# Altium schematic sheet Attenuator.SchDoc: =ProjectName
size 420 x 297 mm; Author: SBH; CompanyName: WUT; DrawnBy: SBH; Organization: CERN; Address1: Warsaw Univeristy of Technology; Address2: Nowowiejska 15/19; Revision: -; SheetNumber: -; SheetTotal: -; EDA_Number: ARTIQ; Projet: ADC/DAC MEZZANINE; ModifiedBy: -; CreateDate: XX/XX/XXXX; CheckedDate: -; Title2: Attenuator.SchDoc; DivGrp: ISE; Designer: SBH; ModifiedDate: -; ProjectName: ADC/DAC MEZZANINE
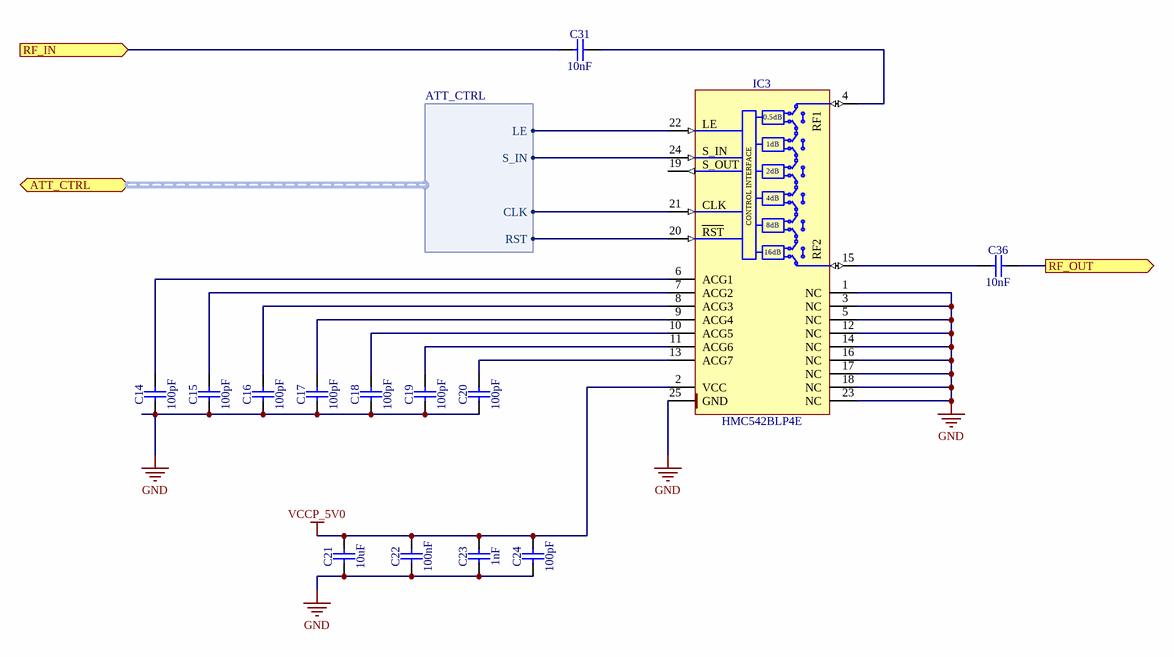
[diagram p0: Attenuator.SchDoc]

## Parts
C14  100pF  [CAPC1005X55N]
C15  100pF  [CAPC1005X55N]
C16  100pF  [CAPC1005X55N]
C17  100pF  [CAPC1005X55N]
C18  100pF  [CAPC1005X55N]
C19  100pF  [CAPC1005X55N]
C20  100pF  [CAPC1005X55N]
C21  10uF  [CAPC1608X80N]
C22  100nF  [CAPC1005X55N]
C23  1nF  [CAPC1005X55N]
C24  100pF  [CAPC1005X55N]
C31  10nF  [CAPC1005X55N]
C36  10nF  [CAPC1005X55N]
IC3  HMC542BLP4E  [QFN50P400X400X100-25N-S295]

## Ports
ATT_CTRL (harness ATT_CTRL), RF_IN (in), RF_OUT (out)

## Harnesses
ATT_CTRL: LE, S_IN, CLK, RST

## Nets
GND: C14.1 C15.1 C16.1 C17.1 C18.1 C19.1 C20.1 C21.1 C22.1 C23.1 C24.1 IC3.1(NC) IC3.3(NC) IC3.5(NC) IC3.12(NC) IC3.14(NC) IC3.16(NC) IC3.17(NC) IC3.18(NC) IC3.23(NC) IC3.25(GND)
VCCP_5V0: C21.2 C22.2 C23.2 C24.2 IC3.2(VCC)
RF_IN: C31.1 ; port RF_IN
RF_OUT: C36.2 ; port RF_OUT
NetC14_2: C14.2 IC3.6(ACG1)
NetC15_2: C15.2 IC3.7(ACG2)
NetC16_2: C16.2 IC3.8(ACG3)
NetC17_2: C17.2 IC3.9(ACG4)
NetC18_2: C18.2 IC3.10(ACG5)
NetC19_2: C19.2 IC3.11(ACG6)
NetC20_2: C20.2 IC3.13(ACG7)
NetC31_2: C31.2 IC3.4(RF1)
NetC36_1: C36.1 IC3.15(RF2)
NetIC3_20: IC3.20(~{RESET}) ; port ATT_CTRL.RST
NetIC3_21: IC3.21(SHIFT_CLOCK) ; port ATT_CTRL.CLK
NetIC3_22: IC3.22(LATCH_ENABLE) ; port ATT_CTRL.LE
NetIC3_24: IC3.24(SERIAL_INPUT) ; port ATT_CTRL.S_IN

Not connected (* = marked no-connect by the designer): IC3 19(SERIAL_OUTPUT)

## Notes on the sheet
- Project/Equipment
- Document
- Designer
- Drawn by
- Check.by
- File
- Last Mod.
- Print Date
- Sheet
- Size
- A3
- of
- Rev
- (in symbol HMC542BLP4E) 0.5dB; LE; 1dB; S_IN; S_OUT; 2dB; CONTROL INTERFACE; 4dB; CLK; 8dB; RST; 16dB

## Library data of the parts
C14-C20 C24 = CC0402_100PF_50V_5%_C0G: Non-polarised capacitor; Part Description: SMD Multilayer Chip Ceramic Capacitor; Manufacturer: GENERIC; Manufacturer1 Part Number: C0402C101J5GACTU; Voltage: 50V; TC: C0G/NP0; Tolerance: ±5%; Part Number: CC0402_100PF_50V_5%_C0G; Component Kind: Standard; Component Type: Standard; Pin Count: 2; Value: 100pF; Status: Preferred; Manufacturer Part Number: CC0402_100PF_50V_5%_C0G; Case: 0402; Mounted: Yes; Socket: No; SMD: Yes; Sense: No; Manufacturer1 Example: KEMET; Manufacturer1 ComponentHeight: 0.55mm; HelpURL: \\cern.ch\dfs\Applications\Altium\Datasheets\CC0805_C0G_KEMET_(Commercial Grade).pdf; Author: CERN DEM JLC; CreateDate: 2007-12-03; LatestRevisionDate: 2015-04-22
C21 = CC0603_10UF_16V_20%_X5R: Non-polarised capacitor; Part Description: SMD Multilayer Chip Ceramic Capacitor; Manufacturer: GENERIC; Manufacturer1 Part Number: GRM188R61C106MA73D; Voltage: 16V; TC: X5R; Tolerance: ±20%; Part Number: CC0603_10UF_16V_20%_X5R; Component Kind: Standard; Component Type: Standard; Pin Count: 2; Value: 10uF; Status: None; Manufacturer Part Number: CC0603_10UF_16V_20%_X5R; Case: 0603; Mounted: Yes; Socket: No; SMD: Yes; Sense: No; Manufacturer1 Example: MURATA; Manufacturer1 ComponentHeight: 0.8mm; HelpURL: \\cern.ch\dfs\Applications\Altium\Datasheets\CC0603_X5R_MURATA_GRM.pdf; Author: CERN DEM MR; CreateDate: 2016-03-02; LatestRevisionDate: 2016-03-02
C22 = CC0402_100NF_16V_10%_X7R: Non-polarised capacitor; Part Description: SMD Multilayer Chip Ceramic Capacitor; Manufacturer: GENERIC; Manufacturer1 Part Number: GRM155R71C104KA88D; Voltage: 16V; TC: X7R; Tolerance: ±10%; Part Number: CC0402_100NF_16V_10%_X7R; Component Kind: Standard; Component Type: Standard; Pin Count: 2; Value: 100nF; Status: Not Recommended; Manufacturer Part Number: CC0402_100NF_16V_10%_X7R; Case: 0402; Mounted: Yes; Socket: No; SMD: Yes; Sense: No; Manufacturer1 Example: MURATA; Manufacturer1 ComponentHeight: 0.55mm; HelpURL: \\cern.ch\dfs\Applications\Altium\Datasheets\CC0402_X7R_MURATA_GRM.pdf; Author: CERN DEM JLC; CreateDate: 2013-12-05; LatestRevisionDate: 2007-12-03
C23 = CC0402_1NF_50V_10%_X7R: Non-polarised capacitor; Part Description: SMD Multilayer Chip Ceramic Capacitor; Manufacturer: GENERIC; Manufacturer1 Part Number: 223858715623; Voltage: 50V; TC: X7R; Tolerance: ±10%; Part Number: CC0402_1NF_50V_10%_X7R; Component Kind: Standard; Component Type: Standard; Pin Count: 2; Value: 1nF; Status: Not Recommended; Manufacturer Part Number: CC0402_1NF_50V_10%_X7R; Case: 0402; Mounted: Yes; Socket: No; SMD: Yes; Sense: No; Manufacturer1 Example: PHYCOMP; Manufacturer1 ComponentHeight: 0.55mm; HelpURL: \\cern.ch\dfs\Applications\Altium\Datasheets\CC0402_X7R_PHYCOMP.pdf; Author: CERN DEM JLC; CreateDate: 2007-12-03; LatestRevisionDate: 2007-12-03
C31 C36 = CC0402_10NF_16V_10%_X7R: Non-polarised capacitor; Part Description: SMD Multilayer Chip Ceramic Capacitor; Manufacturer: GENERIC; Manufacturer1 Part Number: 223878715636; Voltage: 16V; TC: X7R; Tolerance: ±10%; Part Number: CC0402_10NF_16V_10%_X7R; Component Kind: Standard; Component Type: Standard; Pin Count: 2; Value: 10nF; Status: Not Recommended; Manufacturer Part Number: CC0402_10NF_16V_10%_X7R; Case: 0402; Mounted: Yes; Socket: No; SMD: Yes; Sense: No; Manufacturer1 Example: PHYCOMP; Manufacturer1 ComponentHeight: 0.55mm; HelpURL: \\cern.ch\dfs\Applications\Altium\Datasheets\CC0402_X7R_PHYCOMP.pdf; Author: CERN DEM JLC; CreateDate: 2007-12-03; LatestRevisionDate: 2007-12-03
IC3 = HMC542BLP4E: 0.5dB LSB GaAs MMIC 6-bit Digital Serial Control Attenuator, DC - 4GHz; Part Description: 0.5dB LSB GaAs MMIC 6-bit Digital Serial Control Attenuator, DC to 4GHz; Manufacturer: HITTITE MICROWAVE CORP; PressFit: No; Bonding: No; Part Number: HMC542BLP4E; Component Kind: Standard; Component Type: Standard; Device: HMC542BLP4E; PackageDescription: QFN, 0.50mm Pitch, Square; 24 Pin, 4.00mm L X 4.00mm W X 1.00mm H Body (w/thermal Tab 2.95 X 2.95mm), IPC Medium Density; Manufacturer Part Number: HMC542BLP4E; Pin Count: 25; Case: QFN24; Mounted: Yes; Socket: No; SMD: Yes; Sense: No; ComponentHeight: 1mm; Author: CERN DEM JMW; HelpURL: \\cern.ch\dfs\Applications\Altium\Datasheets\HMC542BLP4E.pdf; CreateDate: 2016-08-17; LatestRevisionDate: 2016-08-17